# Altium schematic sheet OSUpcb.SchDoc
size A4
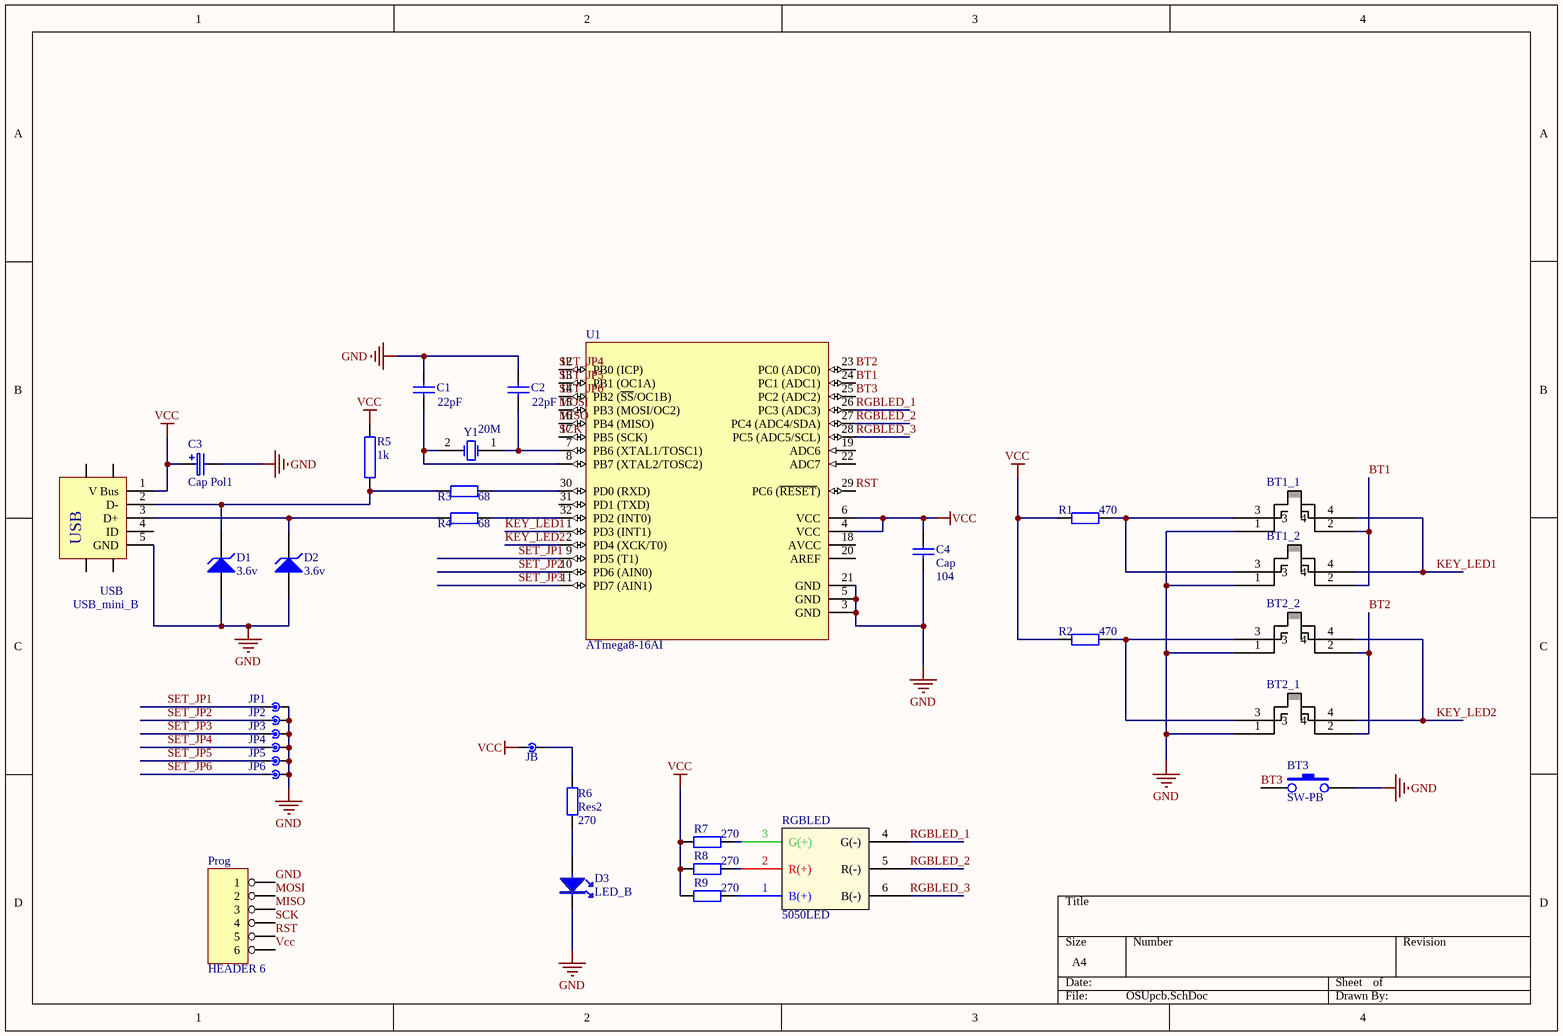
[diagram p0: OSUpcb.SchDoc]

## Parts
BT1_1  JiXieJianPian  [JiXieJianPanwithLED_5foot]  (value not drawn)
BT1_2  JiXieJianPian  [JiXieJianPanwithLED_5foot]  (value not drawn)
BT2_1  JiXieJianPian  [JiXieJianPanwithLED_5foot]  (value not drawn)
BT2_2  JiXieJianPian  [JiXieJianPanwithLED_5foot]  (value not drawn)
BT3  SW-PB  [SW6*6]
C1  value 22pF  [C0805]  (hidden comment: Cap)
C2  value 22pF  [C0805]  (hidden comment: Cap)
C3  Cap Pol1  [CC6032]
C4  Cap  value 104  [C0805]
D1  3.6v  [DO1206]
D2  3.6v  [DO1206]
D3  LED_B  [LED_0805]
JB  JP2  [JP]  (value not drawn)
JP1  JP2  [JP]  (value not drawn)
JP2  JP2  [JP]  (value not drawn)
JP3  JP2  [JP]  (value not drawn)
JP4  JP2  [JP]  (value not drawn)
JP5  JP2  [JP]  (value not drawn)
JP6  JP2  [JP]  (value not drawn)
Prog  HEADER 6  [HDR1X6]
R1  value 470  [R0805]  (hidden comment: Res2)
R2  value 470  [R0805]  (hidden comment: Res2)
R3  value 68  [r0805]  (hidden comment: Res2)
R4  value 68  [r0805]  (hidden comment: Res2)
R5  1k  [R0805]
R6  Res2  value 270  [R0805]
R7  value 270  [R0805]  (hidden comment: Res2)
R8  value 270  [R0805]  (hidden comment: Res2)
R9  value 270  [R0805]  (hidden comment: Res2)
RGBLED  5050LED  [LED5050]
U1  ATmega8-16AI  [32A_N]
USB  USB_mini_B  [mini-usb_B-TYPE_5P]
Y1  20M  [XTAL-DIP-2L]

## Nets
GND: BT1_1.1 BT1_2.1 BT2_1.1 BT2_2.1 BT3.2 C1.2 C2.2 C3.2 C4.1 D1.1(A) D2.1(A) D3.2 JP1.1 JP2.1 JP3.1 JP4.1 JP5.1 JP6.1 Prog.1 U1.3(GND) U1.5(GND) U1.21(GND) USB.5(GND)
Vcc: C3.1 C4.2 JB.2 Prog.6 R1.1 R2.1 R5.1 R7.2 R8.2 R9.2 U1.4(VCC) U1.6(VCC) USB.1(V_Bus)
BT1: BT1_1.2 BT1_2.2 U1.24(PC1_(ADC1))
BT2: BT2_1.2 BT2_2.2 U1.23(PC0_(ADC0))
BT3: BT3.1 U1.25(PC2_(ADC2))
KEY_LED1: BT1_1.4 BT1_2.4 U1.1(PD3_(INT1))
KEY_LED2: BT2_1.4 BT2_2.4 U1.2(PD4_(XCK/T0))
MISO: Prog.3 U1.16(PB4_(MISO))
MOSI: Prog.2 U1.15(PB3_(MOSI/OC2))
RGBLED_1: RGBLED.4(G(-)) U1.26(PC3_(ADC3))
RGBLED_2: RGBLED.5(R(-)) U1.27(PC4_(ADC4/SDA))
RGBLED_3: RGBLED.6(B(-)) U1.28(PC5_(ADC5/SCL))
RST: Prog.5 U1.29(PC6_(~{RESET}))
SCK: Prog.4 U1.17(PB5_(SCK))
SET_JP1: JP1.2 U1.9(PD5_(T1))
SET_JP2: JP2.2 U1.10(PD6_(AIN0))
SET_JP3: JP3.2 U1.11(PD7_(AIN1))
SET_JP4: JP4.2 U1.12(PB0_(ICP))
SET_JP5: JP5.2 U1.13(PB1_(OC1A))
SET_JP6: JP6.2 U1.14(PB2_(~{SS}/OC1B))
NetBT1_1_3: BT1_1.3 BT1_2.3 R1.2
NetBT2_1_3: BT2_1.3 BT2_2.3 R2.2
NetC1_1: C1.1 U1.8(PB7_(XTAL2/TOSC2)) Y1.2(OSC2)
NetC2_1: C2.1 U1.7(PB6_(XTAL1/TOSC1)) Y1.1(OSC1)
NetD1_2: D1.2(K) R3.1 R5.2 USB.2(D-)
NetD2_2: D2.2(K) R4.1 USB.3(D+)
NetD3_1: D3.1 R6.1
NetJB_1: JB.1 R6.2
NetR3_2: R3.2 U1.30(PD0_(RXD))
NetR4_2: R4.2 U1.32(PD2_(INT0))
NetR7_1: R7.1 RGBLED.3(G(+))
NetR8_1: R8.1 RGBLED.2(R(+))
NetR9_1: R9.1 RGBLED.1(B(+))

Not connected (* = marked no-connect by the designer): U1 18(AVCC) 19(ADC6) 20(AREF) 22(ADC7) 31(PD1_(TXD)); USB 0 4(ID)

## Library data of the parts
C1 C2 C4 = Cap: Capacitor; Published: 8-Jun-2000; LatestRevisionDate: 17-Jul-2002; LatestRevisionNote: Re-released for DXP Platform.; PackageReference: RAD-0.3; Publisher: Altium Limited
C3 = Cap Po: Polarized Capacitor (Radial); Published: 8-Jun-2000; LatestRevisionDate: 17-Jul-2002; LatestRevisionNote: Re-released for DXP Platform.; PackageReference: RB7.6-15; Publisher: Altium Limited
D1 D2 = D Zener: Zener Diode; Published: 8-Jun-2000; LatestRevisionDate: 17-Jul-2002; LatestRevisionNote: Re-released for DXP Platform.; PackageReference: DIODE-0.7; Publisher: Altium Limited
R1-R4 R6-R9 = Res2: Resistor; Published: 8-Jun-2000; LatestRevisionDate: 17-Jul-2002; LatestRevisionNote: Re-released for DXP Platform.; PackageReference: AXIAL-0.4; Publisher: Altium Limited
R5 = RES
U1 = ATmega8-16AI: 8-Bit AVR Microcontroller with 8K Bytes of In-System Programmable Flash Memory; Published: 17-Sep-2003; LatestRevisionDate: 13-Apr-2006; LatestRevisionNote: IPC-7351 Footprint Added.; DatasheetVersion: 2486H-AVR-09/02; PackageVersion: revB, Oct-2001; PackageReference: 32A; Publisher: Altium Limited; PackageDescription: 32-Pin Thin Quad Flat Pack 0.8 mm Pitch; Code_JEDEC: MS-026-ABA; ComponentLink1Description: Manufacturer Link; ComponentLink1URL: http://www.atmel.com; ComponentLink2Description: Datasheet; ComponentLink2URL: http://www.atmel.com/dyn/resources/prod_documents/doc2486.pdf
USB = USB_min
Y1 = XTAL: Crystal Oscillator; Published: 8-Jun-2000; LatestRevisionDate: 17-Jul-2002; LatestRevisionNote: Re-released for DXP Platform.; PackageReference: R38; Publisher: Altium Limited